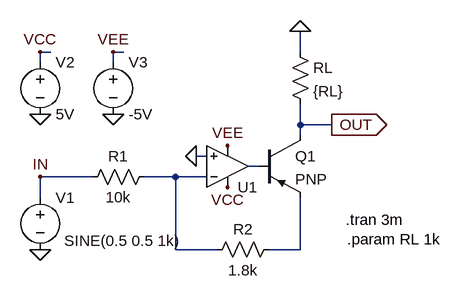
[diagram p0: schematic V-I Convert.asc]
V-I Convert.asc, the LTspice schematic file:
Version 4
SHEET 1 880 680
WIRE -32 -16 -48 -16
WIRE 80 -16 64 -16
WIRE 352 -16 352 -48
WIRE -48 0 -48 -16
WIRE 64 0 64 -16
WIRE 352 96 352 64
WIRE 400 96 352 96
WIRE 352 112 352 96
WIRE 208 144 192 144
WIRE 288 160 272 160
WIRE 32 176 -48 176
WIRE 160 176 112 176
WIRE 208 176 160 176
WIRE -48 208 -48 176
WIRE 160 288 160 176
WIRE 224 288 160 288
WIRE 352 288 352 208
WIRE 352 288 304 288
FLAG 192 144 0
FLAG 352 -48 0
FLAG 240 192 VCC
FLAG 240 128 VEE
FLAG -48 288 0
FLAG -48 80 0
FLAG -48 -16 VCC
FLAG 64 80 0
FLAG 64 -16 VEE
FLAG -48 176 IN
FLAG 400 96 OUT
IOPIN 400 96 Out
SYMBOL Opamps\\UniversalOpamp2 240 160 M180
SYMATTR InstName U1
SYMBOL res 128 160 R90
WINDOW 0 0 56 VBottom 2
WINDOW 3 32 56 VTop 2
SYMATTR InstName R1
SYMATTR Value 10k
SYMBOL res 320 272 R90
WINDOW 0 0 56 VBottom 2
WINDOW 3 32 56 VTop 2
SYMATTR InstName R2
SYMATTR Value 1.8k
SYMBOL pnp 288 112 R0
SYMATTR InstName Q1
SYMBOL res 336 -32 R0
SYMATTR InstName RL
SYMATTR Value {RL}
SYMBOL voltage -48 192 R0
WINDOW 3 37 82 Left 2
WINDOW 123 0 0 Left 2
WINDOW 39 0 0 Left 2
SYMATTR InstName V1
SYMATTR Value SINE(0.5 0.5 1k)
SYMBOL voltage -48 -16 R0
SYMATTR InstName V2
SYMATTR Value 5V
SYMBOL voltage 64 -16 R0
WINDOW 123 0 0 Left 2
WINDOW 39 0 0 Left 2
SYMATTR InstName V3
SYMATTR Value -5V
TEXT 422 242 Left 2 !.tran 3m
TEXT 424 272 Left 2 !.param RL 1k

The netlist it stands for:
* V-I Convert.asc
XU1 0 N002 VCC VEE N001 level.2 Avol=1Meg GBW=10Meg Slew=10Meg ilimit=25m rail=0 Vos=0 phimargin=45 en=0 enk=0 in=0 ink=0 Rin=500Meg  ; pins IN+ IN- V+ V- OUT
R1 N002 IN 10k
R2 N003 N002 1.8k
Q1 OUT N001 N003 0 PNP
RL 0 OUT {RL}
V1 IN 0 SINE(0.5 0.5 1k)
V2 VCC 0 5V
V3 VEE 0 -5V
.model NPN NPN
.model PNP PNP
.lib standard.bjt
.tran 3m
.param RL 1k
.lib UniversalOpamps2.sub
.backanno
.end